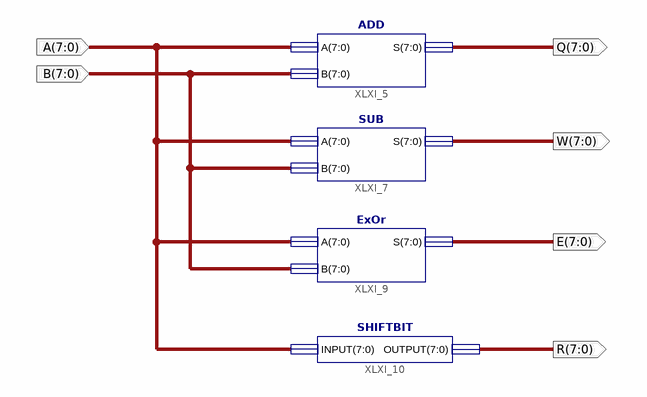
[diagram p0: schematic sheet 1]
// Xilinx ISE schematic OPERATE.sch (spartan6) as structural Verilog: 4 symbols, 6 ports
module OPERATE (
  input  [7:0] B,
  input  [7:0] A,
  output [7:0] Q,
  output [7:0] W,
  output [7:0] E,
  output [7:0] R
);

  SUB XLXI_7 (.A(A), .B(B), .S(W));
  ADD XLXI_5 (.A(A), .B(B), .S(Q));
  ExOr XLXI_9 (.A(A), .B(B), .S(E));
  SHIFTBIT XLXI_10 (.INPUT(A), .OUTPUT(R));
endmodule
